# EAGLE schematic vRef+Therm_Mod_pnl (EAGLE 8.0.1)
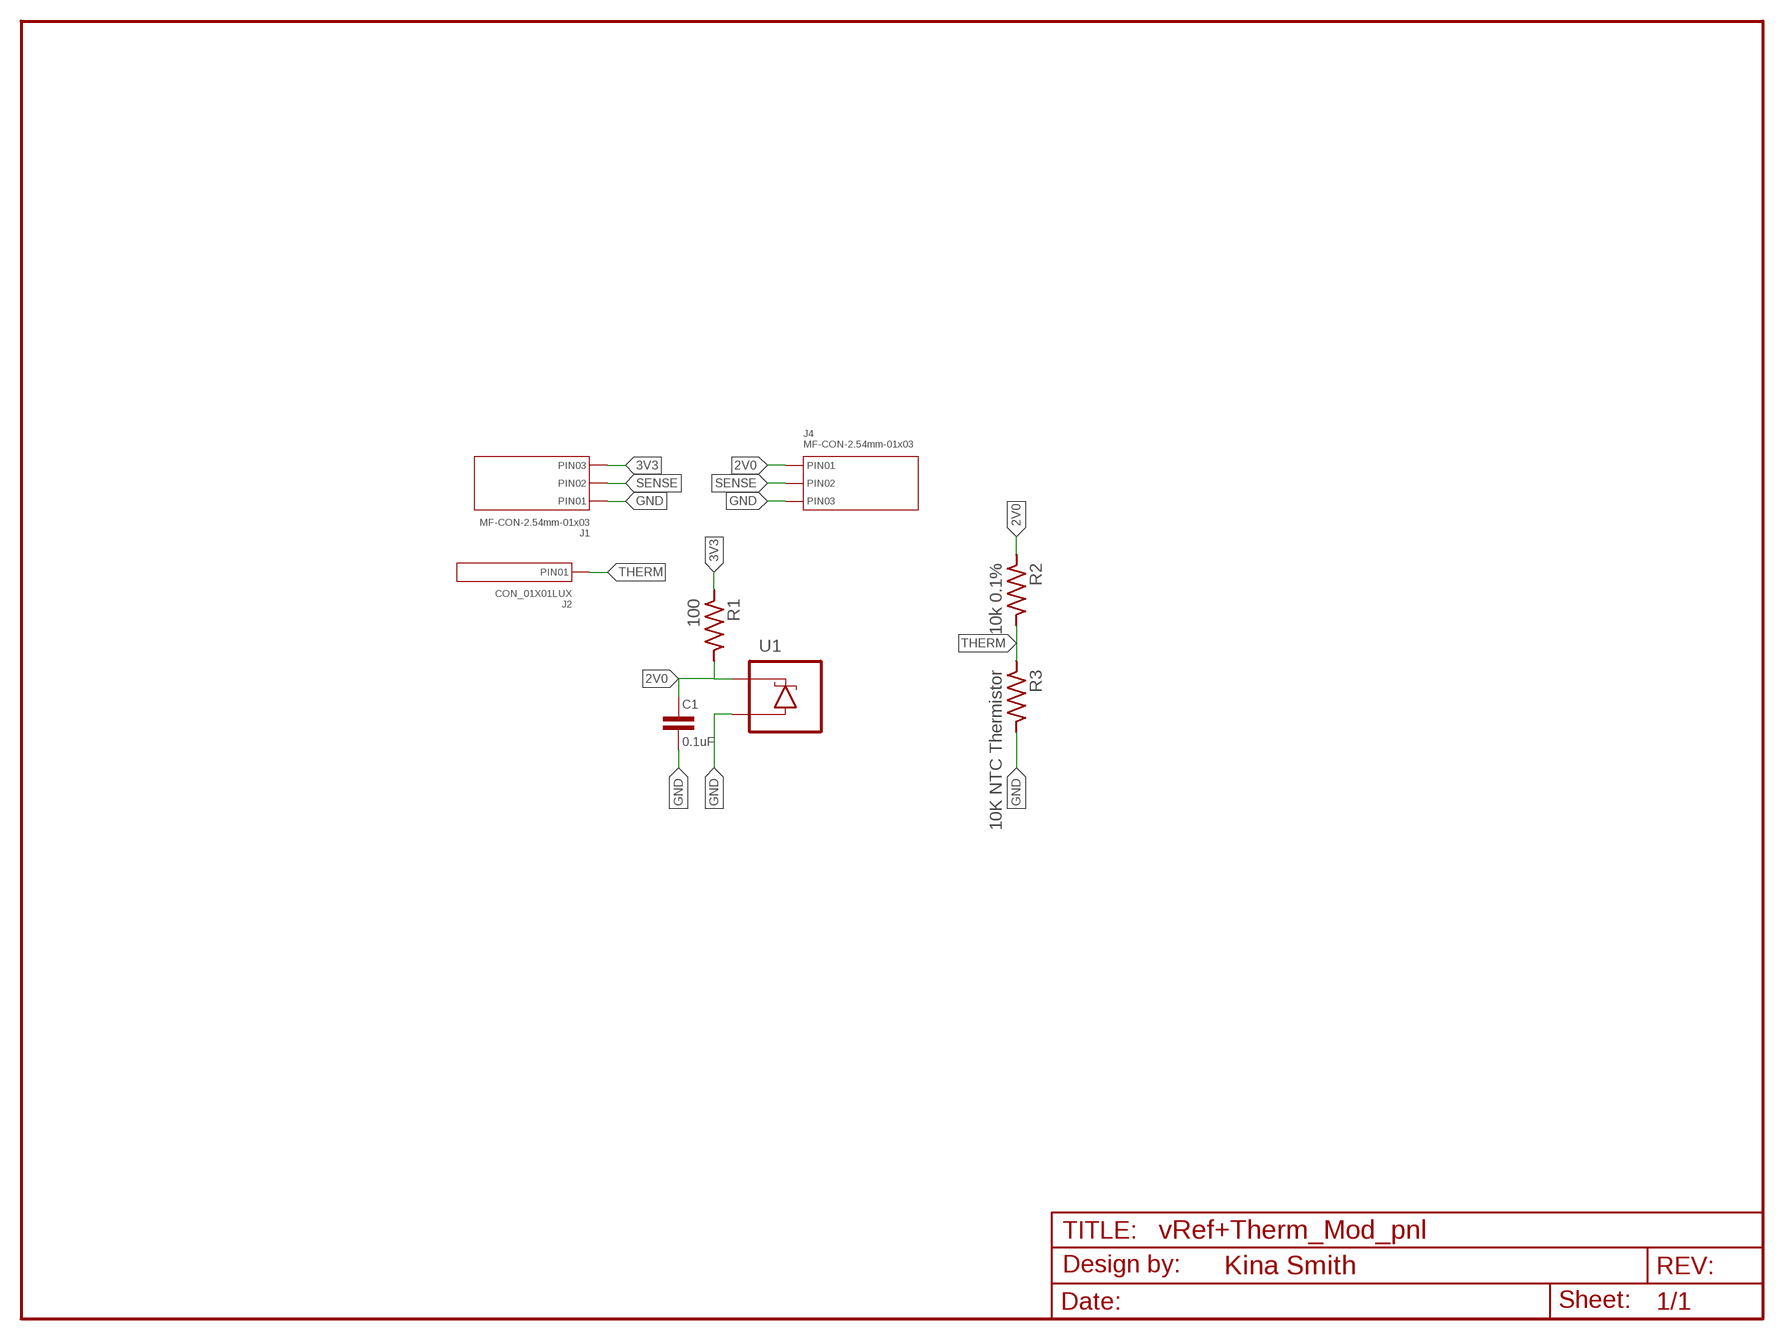
[diagram p0: schematic, sheet 1]

## Parts
C1  0.1uF  CAPACITOR_NP0603-N  [C0603-N]
FRAME1  FRAME-LETTERNO_PACKAGE  [DUMMY]
J1  MF-CON-2.54mm-01x03  CON_01X03_PTH_2.54MM  [PTH_2.54MM_01X03]
J2  CON_01X01LUX  [1X01_LUXEON-PAD]
J4  MF-CON-2.54mm-01x03  CON_01X03_PTH_2.54MM  [PTH_2.54MM_01X03]
R1  100  RESISTOR0603-N  [R0603-N]
R2  10k 0.1%  RESISTOR0603-N  [R0603-N]
R3  10K NTC Thermistor  RESISTOR0603-N  [R0603-N]
U1  LM4040-SOT-23-3  [SOT23-3]

## Nets
2V0: C1.1 J4.P$1(PIN1) R1.2 R2.1 U1.1(C)
3V3: J1.P$3(PIN3) R1.1
GND: C1.2 J1.P$1(PIN1) J4.P$3(PIN3) R3.2 U1.2(A)
SENSE: J1.P$2(PIN2) J4.P$2(PIN2)
THERM: J2.P$1(PIN1) R2.2 R3.1

## Library data of the parts
C1 = My_Passives:CAPACITOR_NP
FRAME1 = My_Aesthetics:FRAME-LETTER: Schematic Frame Standard 8.5x11 US Letter frame; DESIGNER: Nobody; PARTNO: NA; VERSION: v01
J1 J4 = My_Connectors:CON_01X03: Library: MF_Connectors Description: Header Connector with 03 Positions and 01 Rows. Use the LABEL Attribute to label the pin on the schematic and PCB. You can remove the attributes on the PCB by using the SMASH function on the part and then deleting the text.; HOUSEPART: YES; MPN: MF-CON-2.54mm-01x03; POPULATE: 1; URL: https://factory.macrofab.com/part/MF-CON-2.54mm-01x03
J2 = My_Connectors:CON_01X01: Library: MF_Connectors Description: Header Connector with 01 Positions and 01 Rows. Use the LABEL Attribute to label the pin on the schematic and PCB. You can remove the attributes on the PCB by using the SMASH function on the part and then deleting the text.
R1-R3 = My_Passives:RESISTOR
U1 = My_Descrete_Semiconductors:LM4040; PARTNO: LM4040AIM3-2.0/NOPB